# Altium schematic sheet Testboard_schematics.SchDoc
size 594 x 420 mm; SheetNumber: 1; SheetTotal: 8
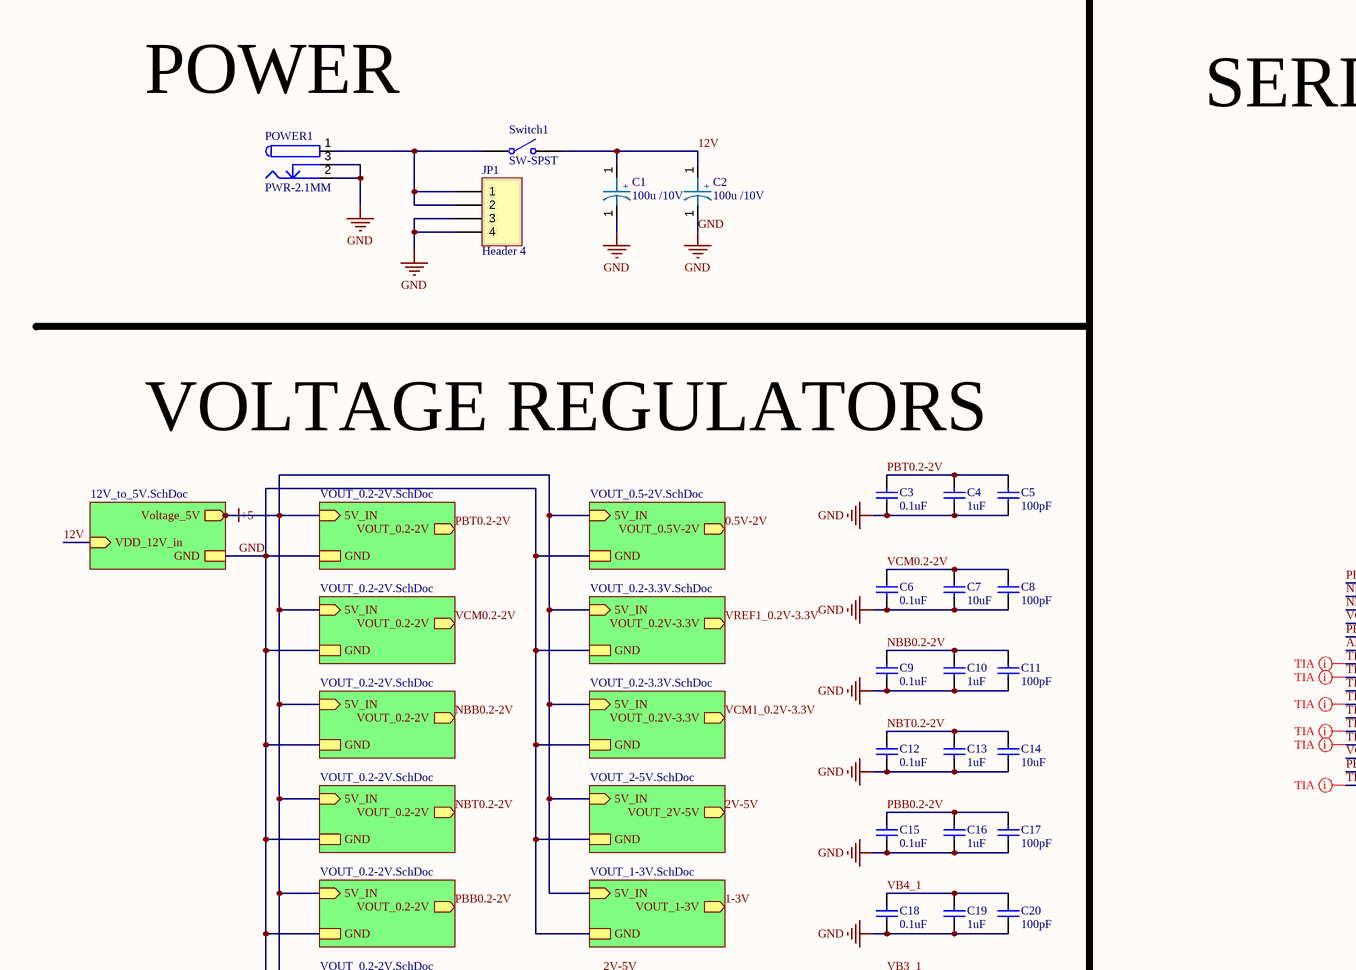
[diagram p0: Testboard_schematics.SchDoc, top left]
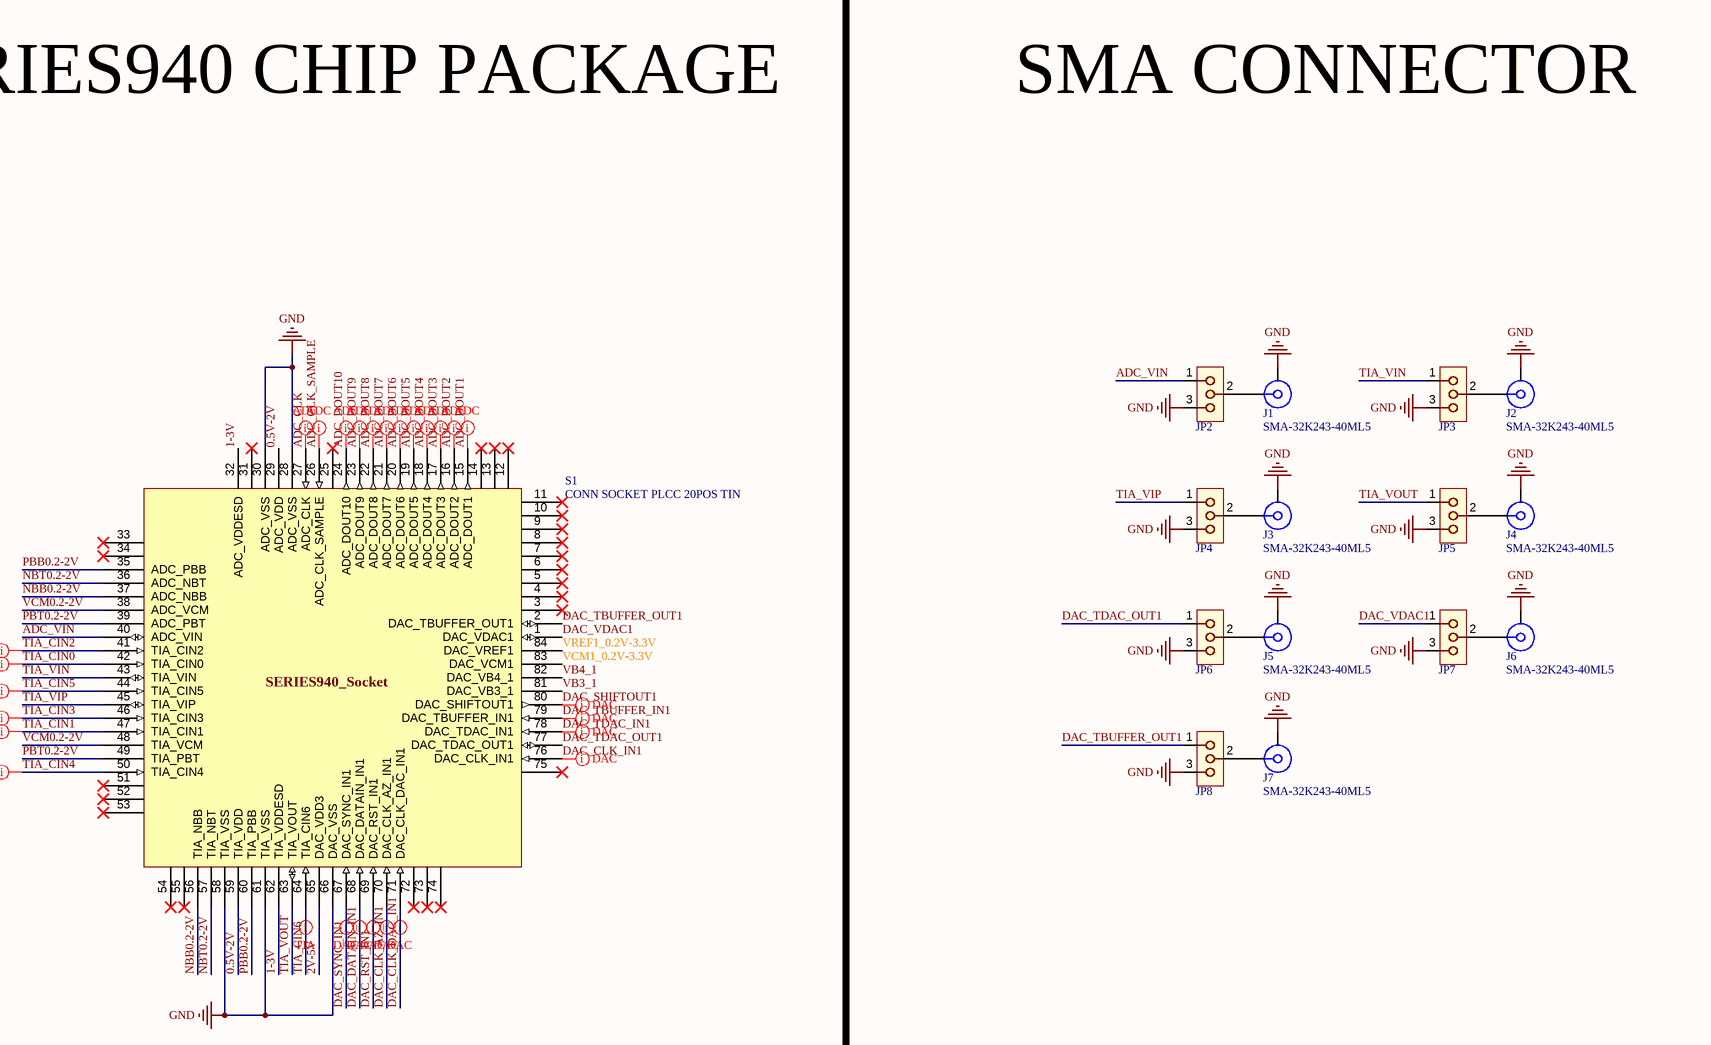
[diagram p1: Testboard_schematics.SchDoc, top right]
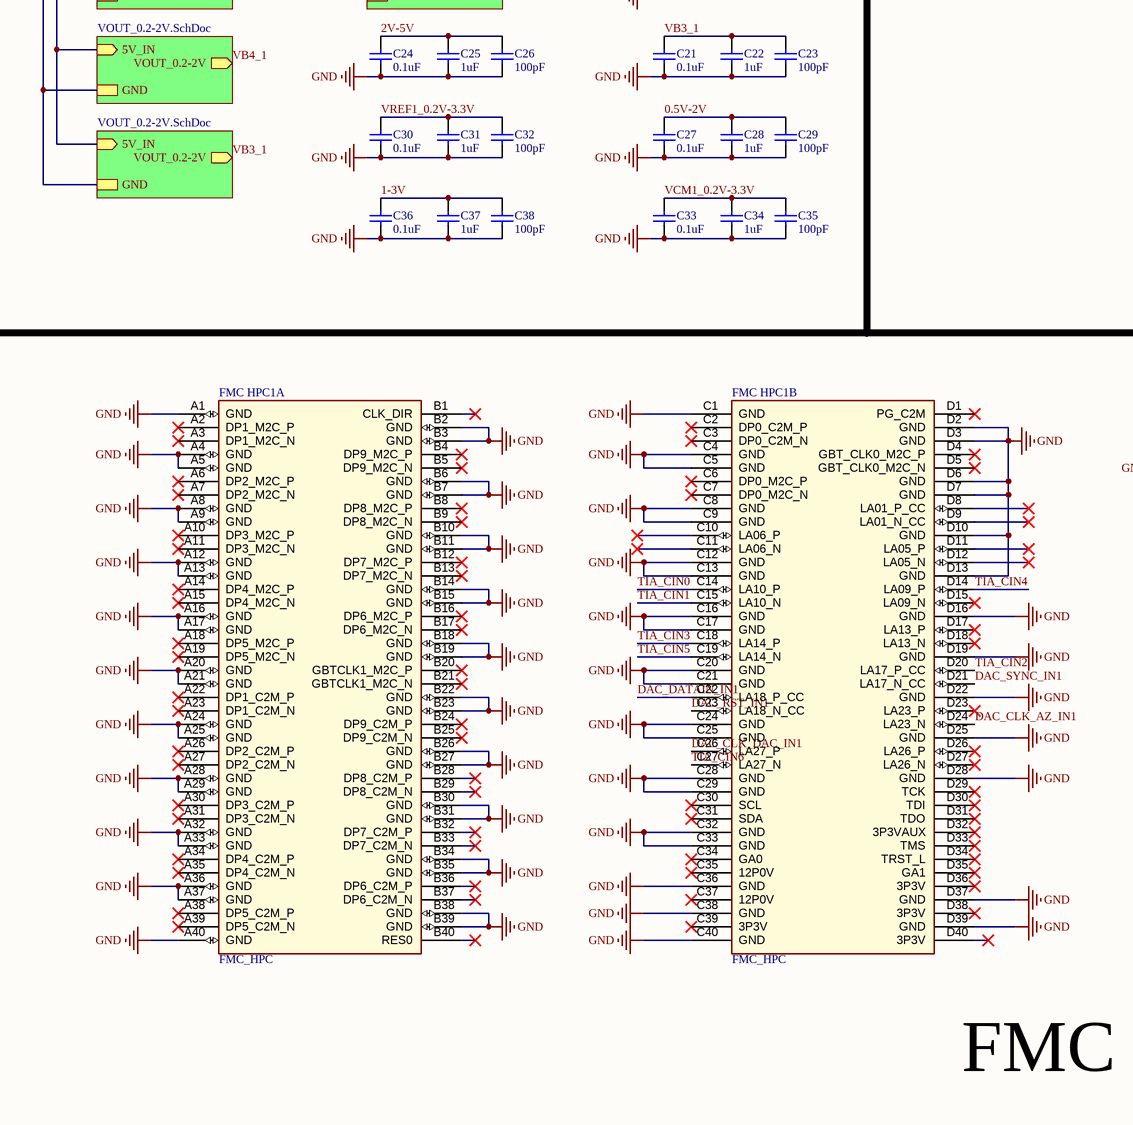
[diagram p2: Testboard_schematics.SchDoc, bottom left]
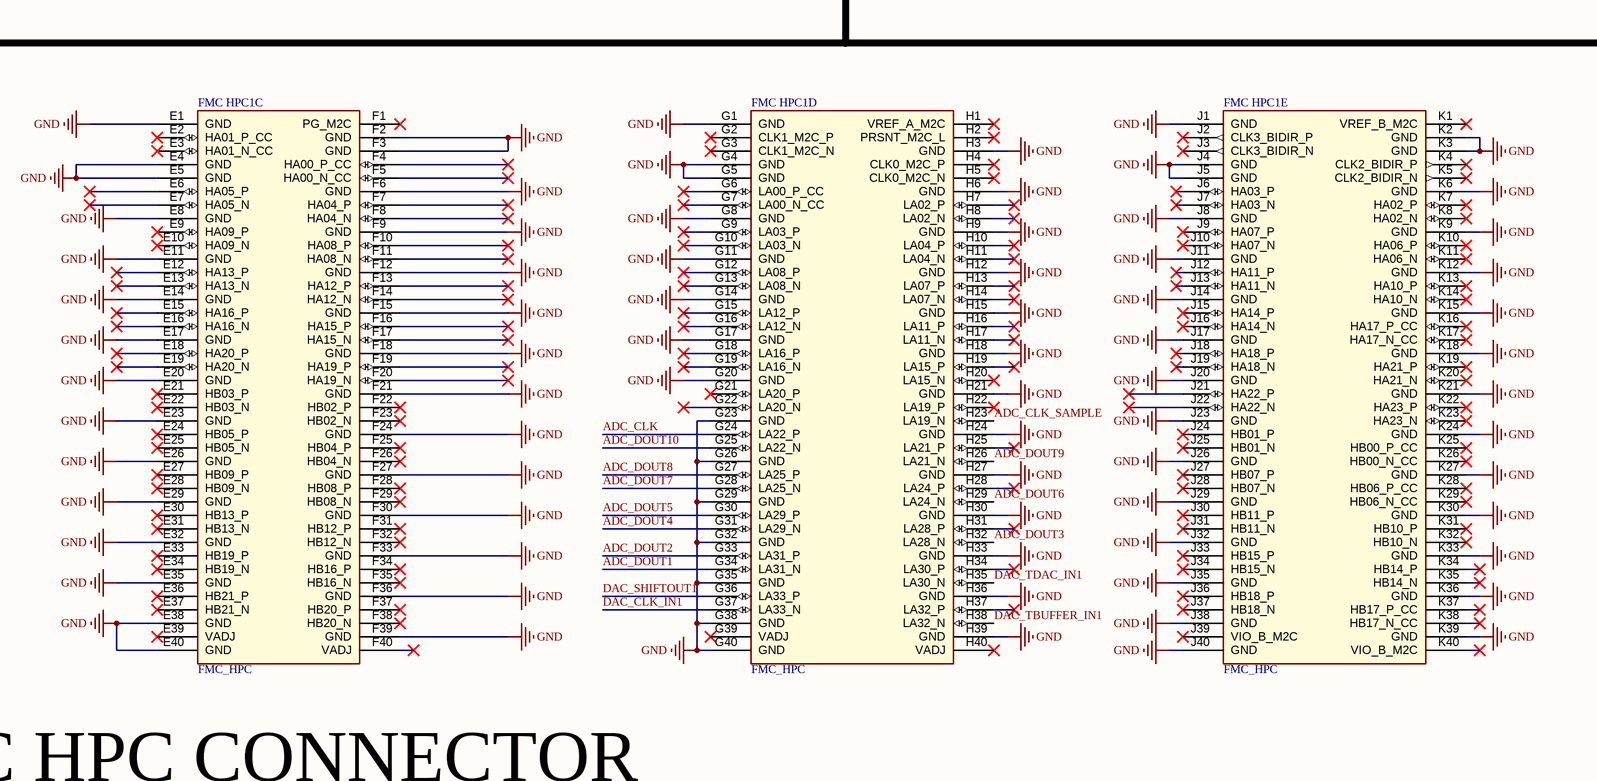
[diagram p3: Testboard_schematics.SchDoc, bottom right]

## Parts
C1  100u /10V  [C_ALU_C_SIZE]
C2  100u /10V  [C_ALU_C_SIZE]
C3  0.1uF  [C0805]
C4  1uF  [C0805]
C5  100pF  [C0805]
C6  0.1uF  [C0805]
C7  10uF  [C0805]
C8  100pF  [C0805]
C9  0.1uF  [C0805]
C10  1uF  [C0805]
C11  100pF  [C0805]
C12  0.1uF  [C0805]
C13  1uF  [C0805]
C14  10uF  [C0805]
C15  0.1uF  [C0805]
C16  1uF  [C0805]
C17  100pF  [C0805]
C18  0.1uF  [C0805]
C19  1uF  [C0805]
C20  100pF  [C0805]
C21  0.1uF  [C0805]
C22  1uF  [C0805]
C23  100pF  [C0805]
C24  0.1uF  [C0805]
C25  1uF  [C0805]
C26  100pF  [C0805]
C27  0.1uF  [C0805]
C28  1uF  [C0805]
C29  100pF  [C0805]
C30  0.1uF  [C0805]
C31  1uF  [C0805]
C32  100pF  [C0805]
C33  0.1uF  [C0805]
C34  1uF  [C0805]
C35  100pF  [C0805]
C36  0.1uF  [C0805]
C37  1uF  [C0805]
C38  100pF  [C0805]
FMC_HPC1  FMC_HPC  [FMC_HPC]  (parts A,B,C,D,E of 5)
J1  SMA-32K243-40ML5  [ROS-32K243-40ML5_V]
J2  SMA-32K243-40ML5  [ROS-32K243-40ML5_V]
J3  SMA-32K243-40ML5  [ROS-32K243-40ML5_V]
J4  SMA-32K243-40ML5  [ROS-32K243-40ML5_V]
J5  SMA-32K243-40ML5  [ROS-32K243-40ML5_V]
J6  SMA-32K243-40ML5  [ROS-32K243-40ML5_V]
J7  SMA-32K243-40ML5  [ROS-32K243-40ML5_V]
JP1  Header 4  [HDR1X4]
JP2  Jumper  [01x03_0.1in_th_straight_b_nom]  (value not drawn)
JP3  Jumper  [01x03_0.1in_th_straight_b_nom]  (value not drawn)
JP4  Jumper  [01x03_0.1in_th_straight_b_nom]  (value not drawn)
JP5  Jumper  [01x03_0.1in_th_straight_b_nom]  (value not drawn)
JP6  Jumper  [01x03_0.1in_th_straight_b_nom]  (value not drawn)
JP7  Jumper  [01x03_0.1in_th_straight_b_nom]  (value not drawn)
JP8  Jumper  [01x03_0.1in_th_straight_b_nom]  (value not drawn)
POWER1  PWR-2.1MM  [POWER2.1MM]
S1  CONN SOCKET PLCC 20POS TIN  [SERIES940_Socket]
Switch1  SW-SPST  [SPST-2]

## Sub-sheets
12V_to_5V = 12V_to_5V.SchDoc: VDD_12V_in (in), GND, Voltage_5V (out)
VOUT_0.2-2V = VOUT_0.2-2V.SchDoc: 5V_IN (in), GND, VOUT_0.2-2V (out)
VOUT_0.2-2V = VOUT_0.2-2V.SchDoc: 5V_IN (in), GND, VOUT_0.2-2V (out)
VOUT_0.2-2V = VOUT_0.2-2V.SchDoc: 5V_IN (in), GND, VOUT_0.2-2V (out)
VOUT_0.2-2V = VOUT_0.2-2V.SchDoc: 5V_IN (in), GND, VOUT_0.2-2V (out)
VOUT_0.2-2V = VOUT_0.2-2V.SchDoc: 5V_IN (in), GND, VOUT_0.2-2V (out)
VOUT_0.2-2V = VOUT_0.2-2V.SchDoc: 5V_IN (in), GND, VOUT_0.2-2V (out)
VOUT_0.2-2V = VOUT_0.2-2V.SchDoc: 5V_IN (in), GND, VOUT_0.2-2V (out)
VOUT_0.2V-3.3V = VOUT_0.2-3.3V.SchDoc: 5V_IN (in), GND, VOUT_0.2V-3.3V (out)
VOUT_0.2V-3.3V = VOUT_0.2-3.3V.SchDoc: 5V_IN (in), GND, VOUT_0.2V-3.3V (out)
VOUT_0.5V-2V = VOUT_0.5-2V.SchDoc: 5V_IN (in), GND, VOUT_0.5V-2V (out)
VOUT_0.9V-5V = VOUT_1-3V.SchDoc: 5V_IN (in), GND, VOUT_1-3V (out)
VOUT_2V-5V = VOUT_2-5V.SchDoc: 5V_IN (in), GND, VOUT_2V-5V (out)

## Nets
+5: sheet 12V_to_5V/Voltage_5V, sheet VOUT_2V-5V/5V_IN, sheet VOUT_0.2-2V/5V_IN, sheet VOUT_0.9V-5V/5V_IN, sheet VOUT_0.5V-2V/5V_IN, sheet VOUT_0.2V-3.3V/5V_IN, sheet VOUT_0.2-2V/5V_IN, sheet VOUT_0.2-2V/5V_IN, sheet VOUT_0.2-2V/5V_IN, sheet VOUT_0.2-2V/5V_IN, sheet VOUT_0.2-2V/5V_IN, sheet VOUT_0.2-2V/5V_IN, sheet VOUT_0.2V-3.3V/5V_IN
GND: C1.1 C2.1 C3.1 C4.2 C5.1 C6.1 C7.1 C8.1 C9.1 C10.2 C11.1 C12.1 C13.2 C14.1 C15.1 C16.2 C17.1 C18.1 C19.2 C20.1 C21.1 C22.2 C23.1 C24.1 C25.2 C26.1 C27.1 C28.2 C29.1 C30.1 C31.2 C32.1 C33.1 C34.2 C35.1 C36.1 C37.2 C38.1 FMC_HPC1.A1(GND) FMC_HPC1.A4(GND) FMC_HPC1.A5(GND) FMC_HPC1.A8(GND) FMC_HPC1.A9(GND) FMC_HPC1.A12(GND) FMC_HPC1.A13(GND) FMC_HPC1.A16(GND) FMC_HPC1.A17(GND) FMC_HPC1.A20(GND) FMC_HPC1.A21(GND) FMC_HPC1.A24(GND) FMC_HPC1.A25(GND) FMC_HPC1.A28(GND) FMC_HPC1.A29(GND) FMC_HPC1.A32(GND) FMC_HPC1.A33(GND) FMC_HPC1.A36(GND) FMC_HPC1.A37(GND) FMC_HPC1.A40(GND) FMC_HPC1.B2(GND) FMC_HPC1.B3(GND) FMC_HPC1.B6(GND) FMC_HPC1.B7(GND) FMC_HPC1.B10(GND) FMC_HPC1.B11(GND) FMC_HPC1.B14(GND) FMC_HPC1.B15(GND) FMC_HPC1.B18(GND) FMC_HPC1.B19(GND) FMC_HPC1.B22(GND) FMC_HPC1.B23(GND) FMC_HPC1.B26(GND) FMC_HPC1.B27(GND) FMC_HPC1.B30(GND) FMC_HPC1.B31(GND) FMC_HPC1.B34(GND) FMC_HPC1.B35(GND) FMC_HPC1.B38(GND) FMC_HPC1.B39(GND) FMC_HPC1.C1(GND) FMC_HPC1.C4(GND) FMC_HPC1.C5(GND) FMC_HPC1.C8(GND) FMC_HPC1.C9(GND) FMC_HPC1.C12(GND) FMC_HPC1.C13(GND) FMC_HPC1.C16(GND) FMC_HPC1.C17(GND) FMC_HPC1.C20(GND) FMC_HPC1.C21(GND) FMC_HPC1.C24(GND) FMC_HPC1.C25(GND) FMC_HPC1.C28(GND) FMC_HPC1.C29(GND) FMC_HPC1.C32(GND) FMC_HPC1.C33(GND) FMC_HPC1.C36(GND) FMC_HPC1.C38(GND) FMC_HPC1.C40(GND) FMC_HPC1.D2(GND) FMC_HPC1.D3(GND) FMC_HPC1.D6(GND) FMC_HPC1.D7(GND) FMC_HPC1.D10(GND) FMC_HPC1.D13(GND) FMC_HPC1.D16(GND) FMC_HPC1.D19(GND) FMC_HPC1.D22(GND) FMC_HPC1.D25(GND) FMC_HPC1.D28(GND) FMC_HPC1.D37(GND) FMC_HPC1.D39(GND) FMC_HPC1.E1(GND) FMC_HPC1.E4(GND) FMC_HPC1.E5(GND) FMC_HPC1.E8(GND) FMC_HPC1.E11(GND) FMC_HPC1.E14(GND) FMC_HPC1.E17(GND) FMC_HPC1.E20(GND) FMC_HPC1.E23(GND) FMC_HPC1.E26(GND) FMC_HPC1.E29(GND) FMC_HPC1.E32(GND) FMC_HPC1.E35(GND) FMC_HPC1.E38(GND) FMC_HPC1.E40(GND) FMC_HPC1.F2(GND) FMC_HPC1.F3(GND) FMC_HPC1.F6(GND) FMC_HPC1.F9(GND) FMC_HPC1.F12(GND) FMC_HPC1.F15(GND) FMC_HPC1.F18(GND) FMC_HPC1.F21(GND) FMC_HPC1.F24(GND) FMC_HPC1.F27(GND) FMC_HPC1.F30(GND) FMC_HPC1.F33(GND) FMC_HPC1.F36(GND) FMC_HPC1.F39(GND) FMC_HPC1.G1(GND) FMC_HPC1.G4(GND) FMC_HPC1.G5(GND) FMC_HPC1.G8(GND) FMC_HPC1.G11(GND) FMC_HPC1.G14(GND) FMC_HPC1.G17(GND) FMC_HPC1.G20(GND) FMC_HPC1.G23(GND) FMC_HPC1.G26(GND) FMC_HPC1.G29(GND) FMC_HPC1.G32(GND) FMC_HPC1.G35(GND) FMC_HPC1.G38(GND) FMC_HPC1.G40(GND) FMC_HPC1.H3(GND) FMC_HPC1.H6(GND) FMC_HPC1.H9(GND) FMC_HPC1.H12(GND) FMC_HPC1.H15(GND) FMC_HPC1.H18(GND) FMC_HPC1.H21(GND) FMC_HPC1.H24(GND) FMC_HPC1.H27(GND) FMC_HPC1.H30(GND) FMC_HPC1.H33(GND) FMC_HPC1.H36(GND) FMC_HPC1.H39(GND) FMC_HPC1.J1(GND) FMC_HPC1.J4(GND) FMC_HPC1.J5(GND) FMC_HPC1.J8(GND) FMC_HPC1.J11(GND) FMC_HPC1.J14(GND) FMC_HPC1.J17(GND) FMC_HPC1.J20(GND) FMC_HPC1.J23(GND) FMC_HPC1.J26(GND) FMC_HPC1.J29(GND) FMC_HPC1.J32(GND) FMC_HPC1.J35(GND) FMC_HPC1.J38(GND) FMC_HPC1.J40(GND) FMC_HPC1.K2(GND) FMC_HPC1.K3(GND) FMC_HPC1.K6(GND) FMC_HPC1.K9(GND) FMC_HPC1.K12(GND) FMC_HPC1.K15(GND) FMC_HPC1.K18(GND) FMC_HPC1.K21(GND) FMC_HPC1.K24(GND) FMC_HPC1.K27(GND) FMC_HPC1.K30(GND) FMC_HPC1.K33(GND) FMC_HPC1.K36(GND) FMC_HPC1.K39(GND) J1.MH J2.MH J3.MH J4.MH J5.MH J6.MH J7.MH JP1.3 JP1.4 JP2.3 JP3.3 JP4.3 JP5.3 JP6.3 JP7.3 JP8.3 POWER1.2 POWER1.3 S1.28(ADC_VSS) S1.30(ADC_VSS) S1.58(TIA_VSS) S1.61(TIA_VSS) S1.66(DAC_VSS) ; sheet 12V_to_5V/GND, sheet VOUT_2V-5V/GND, sheet VOUT_0.2-2V/GND, sheet VOUT_0.9V-5V/GND, sheet VOUT_0.5V-2V/GND, sheet VOUT_0.2V-3.3V/GND, sheet VOUT_0.2-2V/GND, sheet VOUT_0.2-2V/GND, sheet VOUT_0.2-2V/GND, sheet VOUT_0.2-2V/GND, sheet VOUT_0.2-2V/GND, sheet VOUT_0.2-2V/GND, sheet VOUT_0.2V-3.3V/GND
0.5V-2V: C27.2 C28.1 C29.2 S1.29(ADC_VDD) S1.59(TIA_VDD) ; sheet VOUT_0.5V-2V/VOUT_0.5V-2V
1-3V: C36.2 C37.1 C38.2 S1.32(ADC_VDDESD) S1.62(TIA_VDDESD) ; sheet VOUT_0.9V-5V/VOUT_1-3V
2V-5V: C24.2 C25.1 C26.2 S1.65(DAC_VDD3) ; sheet VOUT_2V-5V/VOUT_2V-5V
12V: C1.1 C2.1 Switch1.2(NO) ; sheet 12V_to_5V/VDD_12V_in
ADC_CLK: FMC_HPC1.G24(LA22_P) S1.27(ADC_CLK)
ADC_CLK_SAMPLE: FMC_HPC1.H23(LA19_N) S1.26(ADC_CLK_SAMPLE)
ADC_DOUT1: FMC_HPC1.G34(LA31_N) S1.15(ADC_DOUT1)
ADC_DOUT2: FMC_HPC1.G33(LA31_P) S1.16(ADC_DOUT2)
ADC_DOUT3: FMC_HPC1.H32(LA28_N) S1.17(ADC_DOUT3)
ADC_DOUT4: FMC_HPC1.G31(LA29_N) S1.18(ADC_DOUT4)
ADC_DOUT5: FMC_HPC1.G30(LA29_P) S1.19(ADC_DOUT5)
ADC_DOUT6: FMC_HPC1.H29(LA24_N) S1.20(ADC_DOUT6)
ADC_DOUT7: FMC_HPC1.G28(LA25_N) S1.21(ADC_DOUT7)
ADC_DOUT8: FMC_HPC1.G27(LA25_P) S1.22(ADC_DOUT8)
ADC_DOUT9: FMC_HPC1.H26(LA21_N) S1.23(ADC_DOUT9)
ADC_DOUT10: FMC_HPC1.G25(LA22_N) S1.24(ADC_DOUT10)
ADC_VIN: JP2.1 S1.40(ADC_VIN)
DAC_CLK_AZ_IN1: FMC_HPC1.D24(LA23_N) S1.70(DAC_CLK_AZ_IN1)
DAC_CLK_DAC_IN1: FMC_HPC1.C26(LA27_P) S1.71(DAC_CLK_DAC_IN1)
DAC_CLK_IN1: FMC_HPC1.G37(LA33_N) S1.76(DAC_CLK_IN1)
DAC_DATAIN_IN1: FMC_HPC1.C22(LA18_P_CC) S1.68(DAC_DATAIN_IN1)
DAC_RST_IN1: FMC_HPC1.C23(LA18_N_CC) S1.69(DAC_RST_IN1)
DAC_SHIFTOUT1: FMC_HPC1.G36(LA33_P) S1.80(DAC_SHIFTOUT1)
DAC_SYNC_IN1: FMC_HPC1.D21(LA17_N_CC) S1.67(DAC_SYNC_IN1)
DAC_TBUFFER_IN1: FMC_HPC1.H38(LA32_N) S1.79(DAC_TBUFFER_IN1)
DAC_TBUFFER_OUT1: JP8.1 S1.2(DAC_TBUFFER_OUT1)
DAC_TDAC_IN1: FMC_HPC1.H35(LA30_N) S1.78(DAC_TDAC_IN1)
DAC_TDAC_OUT1: JP6.1 S1.77(DAC_TDAC_OUT1)
DAC_VDAC1: JP7.1 S1.1(DAC_VDAC1)
NBB0.2-2V: C9.2 C10.1 C11.2 S1.37(ADC_NBB) S1.56(TIA_NBB) ; sheet VOUT_0.2-2V/VOUT_0.2-2V
NBT0.2-2V: C12.2 C13.1 C14.2 S1.36(ADC_NBT) S1.57(TIA_NBT) ; sheet VOUT_0.2-2V/VOUT_0.2-2V
PBB0.2-2V: C15.2 C16.1 C17.2 S1.35(ADC_PBB) S1.60(TIA_PBB) ; sheet VOUT_0.2-2V/VOUT_0.2-2V
PBT0.2-2V: C3.2 C4.1 C5.2 S1.39(ADC_PBT) S1.49(TIA_PBT) ; sheet VOUT_0.2-2V/VOUT_0.2-2V
TIA_CIN0: FMC_HPC1.C14(LA10_P) S1.42(TIA_CIN0)
TIA_CIN1: FMC_HPC1.C15(LA10_N) S1.47(TIA_CIN1)
TIA_CIN2: FMC_HPC1.D20(LA17_P_CC) S1.41(TIA_CIN2)
TIA_CIN3: FMC_HPC1.C18(LA14_P) S1.46(TIA_CIN3)
TIA_CIN4: FMC_HPC1.D14(LA09_P) S1.50(TIA_CIN4)
TIA_CIN5: FMC_HPC1.C19(LA14_N) S1.44(TIA_CIN5)
TIA_CIN6: FMC_HPC1.C27(LA27_N) S1.64(TIA_CIN6)
TIA_VIN: JP3.1 S1.43(TIA_VIN)
TIA_VIP: JP4.1 S1.45(TIA_VIP)
TIA_VOUT: JP5.1 S1.63(TIA_VOUT)
VB3_1: C21.2 C22.1 C23.2 S1.81(DAC_VB3_1) ; sheet VOUT_0.2-2V/VOUT_0.2-2V
VB4_1: C18.2 C19.1 C20.2 S1.82(DAC_VB4_1) ; sheet VOUT_0.2-2V/VOUT_0.2-2V
VCM0.2-2V: C6.2 C7.2 C8.2 S1.38(ADC_VCM) S1.48(TIA_VCM) ; sheet VOUT_0.2-2V/VOUT_0.2-2V
VCM1_0.2V-3.3V: C33.2 C34.1 C35.2 S1.83(DAC_VCM1) ; sheet VOUT_0.2V-3.3V/VOUT_0.2V-3.3V
VREF1_0.2V-3.3V: C30.2 C31.1 C32.2 S1.84(DAC_VREF1) ; sheet VOUT_0.2V-3.3V/VOUT_0.2V-3.3V
NetJ1_1: J1.1 JP2.2
NetJ2_1: J2.1 JP3.2
NetJ3_1: J3.1 JP4.2
NetJ4_1: J4.1 JP5.2
NetJ5_1: J5.1 JP6.2
NetJ6_1: J6.1 JP7.2
NetJ7_1: J7.1 JP8.2
NetJP1_1: JP1.1 JP1.2 POWER1.1 Switch1.1(COMMON)

Not connected (* = marked no-connect by the designer): FMC_HPC1 A2(DP1_M2C_P)* A3(DP1_M2C_N)* A6(DP2_M2C_P)* A7(DP2_M2C_N)* A10(DP3_M2C_P)* A11(DP3_M2C_N)* A14(DP4_M2C_P)* A15(DP4_M2C_N)* A18(DP5_M2C_P)* A19(DP5_M2C_N)* A22(DP1_C2M_P)* A23(DP1_C2M_N)* A26(DP2_C2M_P)* A27(DP2_C2M_N)* A30(DP3_C2M_P)* A31(DP3_C2M_N)* A34(DP4_C2M_P)* A35(DP4_C2M_N)* A38(DP5_C2M_P)* A39(DP5_C2M_N)* B1(CLK_DIR)* B4(DP9_M2C_P)* B5(DP9_M2C_N)* B8(DP8_M2C_P)* B9(DP8_M2C_N)* B12(DP7_M2C_P)* B13(DP7_M2C_N)* B16(DP6_M2C_P)* B17(DP6_M2C_N)* B20(GBTCLK1_M2C_P)* B21(GBTCLK1_M2C_N)* B24(DP9_C2M_P)* B25(DP9_C2M_N)* B28(DP8_C2M_P)* B29(DP8_C2M_N)* B32(DP7_C2M_P)* B33(DP7_C2M_N)* B36(DP6_C2M_P)* B37(DP6_C2M_N)* B40(RES0)* C2(DP0_C2M_P)* C3(DP0_C2M_N)* C6(DP0_M2C_P)* C7(DP0_M2C_N)* C10(LA06_P)* C11(LA06_N)* C30(SCL)* C31(SDA)* C34(GA0)* C35(12P0V)* C37(12P0V)* C39(3P3V)* D1(PG_C2M)* D4(GBT_CLK0_M2C_P)* D5(GBT_CLK0_M2C_N)* D8(LA01_P_CC)* D9(LA01_N_CC)* D11(LA05_P)* D12(LA05_N)* D15(LA09_N)* D17(LA13_P)* D18(LA13_N)* D23(LA23_P)* D26(LA26_P)* D27(LA26_N)* D29(TCK)* D30(TDI)* D31(TDO)* D32(3P3VAUX)* D33(TMS)* D34(TRST_L)* D35(GA1)* D36(3P3V)* D38(3P3V)* D40(3P3V)* E2(HA01_P_CC)* E3(HA01_N_CC)* E6(HA05_P)* E7(HA05_N)* E9(HA09_P)* E10(HA09_N)* E12(HA13_P)* E13(HA13_N)* E15(HA16_P)* E16(HA16_N)* E18(HA20_P)* E19(HA20_N)* E21(HB03_P)* E22(HB03_N)* E24(HB05_P)* E25(HB05_N)* E27(HB09_P)* E28(HB09_N)* E30(HB13_P)* E31(HB13_N)* E33(HB19_P)* E34(HB19_N)* E36(HB21_P)* E37(HB21_N)* E39(VADJ)* F1(PG_M2C)* F4(HA00_P_CC)* F5(HA00_N_CC)* F7(HA04_P)* F8(HA04_N)* F10(HA08_P)* F11(HA08_N)* F13(HA12_P)* F14(HA12_N)* F16(HA15_P)* F17(HA15_N)* F19(HA19_P)* F20(HA19_N)* F22(HB02_P)* F23(HB02_N)* F25(HB04_P)* F26(HB04_N)* F28(HB08_P)* F29(HB08_N)* F31(HB12_P)* F32(HB12_N)* F34(HB16_P)* F35(HB16_N)* F37(HB20_P)* F38(HB20_N)* F40(VADJ)* G2(CLK1_M2C_P)* G3(CLK1_M2C_N)* G6(LA00_P_CC)* G7(LA00_N_CC)* G9(LA03_P)* G10(LA03_N)* G12(LA08_P)* G13(LA08_N)* G15(LA12_P)* G16(LA12_N)* G18(LA16_P)* G19(LA16_N)* G21(LA20_P)* G22(LA20_N)* G39(VADJ)* H1(VREF_A_M2C)* H2(PRSNT_M2C_L)* H4(CLK0_M2C_P)* H5(CLK0_M2C_N)* H7(LA02_P)* H8(LA02_N)* H10(LA04_P)* H11(LA04_N)* H13(LA07_P)* H14(LA07_N)* H16(LA11_P)* H17(LA11_N)* H19(LA15_P)* H20(LA15_N)* H22(LA19_P)* H25(LA21_P)* H28(LA24_P)* H31(LA28_P)* H34(LA30_P)* H37(LA32_P)* H40(VADJ)* J2(CLK3_BIDIR_P)* J3(CLK3_BIDIR_N)* J6(HA03_P)* J7(HA03_N)* J9(HA07_P)* J10(HA07_N)* J12(HA11_P)* J13(HA11_N)* J15(HA14_P)* J16(HA14_N)* J18(HA18_P)* J19(HA18_N)* J21(HA22_P)* J22(HA22_N)* J24(HB01_P)* J25(HB01_N)* J27(HB07_P)* J28(HB07_N)* J30(HB11_P)* J31(HB11_N)* J33(HB15_P)* J34(HB15_N)* J36(HB18_P)* J37(HB18_N)* J39(VIO_B_M2C)* K1(VREF_B_M2C)* K4(CLK2_BIDIR_P)* K5(CLK2_BIDIR_N)* K7(HA02_P)* K8(HA02_N)* K10(HA06_P)* K11(HA06_N)* K13(HA10_P)* K14(HA10_N)* K16(HA17_P_CC)* K17(HA17_N_CC)* K19(HA21_P)* K20(HA21_N)* K22(HA23_P)* K23(HA23_N)* K25(HB00_P_CC)* K26(HB00_N_CC)* K28(HB06_P_CC)* K29(HB06_N_CC)* K31(HB10_P)* K32(HB10_N)* K34(HB14_P)* K35(HB14_N)* K37(HB17_P_CC)* K38(HB17_N_CC)* K40(VIO_B_M2C)*; S1 3* 4* 5* 6* 7* 8* 9* 10* 11* 12* 13* 14* 25* 31* 33* 34* 51* 52* 53* 54* 55* 72* 73* 74* 75*

## Layout directives
net class TIA: TIA_CIN0, TIA_CIN1, TIA_CIN2, TIA_CIN3, TIA_CIN4, TIA_CIN5, TIA_CIN6
net class ADC: ADC_CLK, ADC_CLK_SAMPLE, ADC_DOUT1, ADC_DOUT2, ADC_DOUT3, ADC_DOUT4, ADC_DOUT5, ADC_DOUT6, ADC_DOUT7, ADC_DOUT8, ADC_DOUT9, ADC_DOUT10
net class DAC: DAC_CLK_AZ_IN1, DAC_CLK_DAC_IN1, DAC_CLK_IN1, DAC_DATAIN_IN1, DAC_RST_IN1, DAC_SHIFTOUT1, DAC_SYNC_IN1, DAC_TBUFFER_IN1, DAC_TDAC_IN1

## Notes on the sheet
- (near POWER1) POWER
- SERIES940 CHIP PACKAGE
- SMA CONNECTOR
- VOLTAGE REGULATORS
- FMC HPC CONNECTOR
- DWG NO:
- REV:
- THIS DOCUMENT AND THE DATA DISCLOSED HEREIN OR
- HEREWITH IS THE PROPERTY OF ALTIUM LIMITED AND MAY
- BE FREELY DISTRIBUTED IN WHOLE. NO RIGHTS ARE
- RESERVED OR EXPRESS OR IMPLIED WARANTEE GIVEN.
- REVISION
- DESCRIPTION
- DATE
- APPROVED
- ENG:
- APPROVALS
- PROJECT
- DSN:
- CHK:
- REFERENCE DOCUMENTS
- PROJECT REVISION:
- TITLE
- DOCUMENT REVISION:
- DESIGN ITEM:
- BOM:
- FAB DWG:
- PCB DWG:
- ASSY DWG:
- SCALE:
- A2
- SIZE
- CAGE CODE
- FILE NAME
- DWG NO.
- SHEET
- OF
- REV
- (in symbol 940-44-020-24-000000) SERIES940_Socket
- (in symbol CAP-10uF) +

## Library data of the parts
C1 C2 = CAP-10uF: CAP ALUM 100UF 20% 10V SMD; Manufacturer: Panasonic Electronic Components; Manufacturer Part Number: EEE-1AA101WR; Lifetime @ Temp.: 1000 Hrs @ 85°C; Polarization: Polar; Surface Mount Land Size: 0.209" L x 0.209" W (5.30mm x 5.30mm); Supplier 1: Digi-Key; RoHS: RoHS Compliant; Category: Capacitors; Stock 1: 89696; Pricing 1: 1=0.31, 10=0.212, 100=0.1272, 500=0.09538 (USD); Packaging: Cut Tape (CT); Part Status: Active; Tolerance: ±20%; ESR (Equivalent Series Resistance): -; Operating Temperature: -40°C ~ 85°C; Ratings: AEC-Q200; Applications: Automotive; Lead Spacing: -; Size / Dimension: 0.197" Dia (5.00mm); Height - Seated (Max): 0.213" (5.40mm); Mounting Type: Surface Mount; Package / Case: Radial, Can - SMD; ComponentLink1URL: https://industrial.panasonic.com/cdbs/www-data/pdf/RDE0000/ABA0000C1145.pdf; ComponentLink1Description: https://industrial.panasonic.com/cdbs/www-data/pdf/RDE0000/ABA0000C1145.pdf; Supplier Part Number 1: PCE3867CT-ND
C3 C6 C9 C12 C15 C18 C21 C24 C27 C30 C33 C36 = Cap 0.1uF: Manufacturer: Taiyo Yuden; Manufacturer Part Number: UMK212SD103KD-T; Dielectric Material: Ceramic; Capacitance: 10nF; Tolerance: 10%; Voltage Rating: 50V; Supplier 1: Digi-Key; Stock 1: 14125; Pricing 1: 1=0.47, 10=0.323, 100=0.1941, 500=0.1455, 1000=0.1229 (USD); Mount: Surface Mount; Case/Package: 0805; Number of Pins: 2; Case Code (Metric): 2012; Case Code (Imperial): 0805; Min Operating Temperature: -55°C; Max Operating Temperature: 125°C; Packaging: Tape and Reel; Package Quantity: 1; Voltage Rating (DC): 50V; Termination: SMD/SMT; Length: 2mm; Height: 0.85mm; Width: 0.049inch; Thickness: 0.037inch; Depth: 1.25mm; Radiation Hardening: No; Lead Free: Lead Free; Halogen Free: Halogen Free; ComponentLink1URL: https://datasheet.ciiva.com/138/umk212sd103kd-t-ss-138661.pdf; ComponentLink1Description: https://datasheet.ciiva.com/138/umk212sd103kd-t-ss-138661.pdf; ComponentLink2URL: https://datasheet.ciiva.com/138/mlcc07-e-138662.pdf; ComponentLink2Description: https://datasheet.ciiva.com/138/mlcc07-e-138662.pdf; ComponentLink3URL: https://datasheet.ciiva.com/138/mlcc07-e-138663.pdf; ComponentLink3Description: https://datasheet.ciiva.com/138/mlcc07-e-138663.pdf; ComponentLink4URL: https://datasheet.ciiva.com/30140/303umk212sd103kd-t-30140925.pdf; ComponentLink4Description: https://datasheet.ciiva.com/30140/303umk212sd103kd-t-30140925.pdf; Supplier Part Number 1: 587-1114-1-ND
C4 C7 C10 C13 C16 C19 C22 C25 C28 C31 C34 C37 = Cap 1uF: Manufacturer: Taiyo Yuden; Manufacturer Part Number: UMK212SD103KD-T; Dielectric Material: Ceramic; Capacitance: 10nF; Tolerance: 10%; Voltage Rating: 50V; Supplier 1: Digi-Key; Stock 1: 14125; Pricing 1: 1=0.47, 10=0.323, 100=0.1941, 500=0.1455, 1000=0.1229 (USD); Mount: Surface Mount; Case/Package: 0805; Number of Pins: 2; Case Code (Metric): 2012; Case Code (Imperial): 0805; Min Operating Temperature: -55°C; Max Operating Temperature: 125°C; Packaging: Tape and Reel; Package Quantity: 1; Voltage Rating (DC): 50V; Termination: SMD/SMT; Length: 2mm; Height: 0.85mm; Width: 0.049inch; Thickness: 0.037inch; Depth: 1.25mm; Radiation Hardening: No; Lead Free: Lead Free; Halogen Free: Halogen Free; ComponentLink1URL: https://datasheet.ciiva.com/138/umk212sd103kd-t-ss-138661.pdf; ComponentLink1Description: https://datasheet.ciiva.com/138/umk212sd103kd-t-ss-138661.pdf; ComponentLink2URL: https://datasheet.ciiva.com/138/mlcc07-e-138662.pdf; ComponentLink2Description: https://datasheet.ciiva.com/138/mlcc07-e-138662.pdf; ComponentLink3URL: https://datasheet.ciiva.com/138/mlcc07-e-138663.pdf; ComponentLink3Description: https://datasheet.ciiva.com/138/mlcc07-e-138663.pdf; ComponentLink4URL: https://datasheet.ciiva.com/30140/303umk212sd103kd-t-30140925.pdf; ComponentLink4Description: https://datasheet.ciiva.com/30140/303umk212sd103kd-t-30140925.pdf; Supplier Part Number 1: 587-1114-1-ND
C5 C8 C11 C14 C17 C20 C23 C26 C29 C32 C35 C38 = Cap 100pF: Manufacturer: Taiyo Yuden; Manufacturer Part Number: UMK212SD103KD-T; Dielectric Material: Ceramic; Capacitance: 10nF; Tolerance: 10%; Voltage Rating: 50V; Supplier 1: Digi-Key; Stock 1: 14125; Pricing 1: 1=0.47, 10=0.323, 100=0.1941, 500=0.1455, 1000=0.1229 (USD); Mount: Surface Mount; Case/Package: 0805; Number of Pins: 2; Case Code (Metric): 2012; Case Code (Imperial): 0805; Min Operating Temperature: -55°C; Max Operating Temperature: 125°C; Packaging: Tape and Reel; Package Quantity: 1; Voltage Rating (DC): 50V; Termination: SMD/SMT; Length: 2mm; Height: 0.85mm; Width: 0.049inch; Thickness: 0.037inch; Depth: 1.25mm; Radiation Hardening: No; Lead Free: Lead Free; Halogen Free: Halogen Free; ComponentLink1URL: https://datasheet.ciiva.com/138/umk212sd103kd-t-ss-138661.pdf; ComponentLink1Description: https://datasheet.ciiva.com/138/umk212sd103kd-t-ss-138661.pdf; ComponentLink2URL: https://datasheet.ciiva.com/138/mlcc07-e-138662.pdf; ComponentLink2Description: https://datasheet.ciiva.com/138/mlcc07-e-138662.pdf; ComponentLink3URL: https://datasheet.ciiva.com/138/mlcc07-e-138663.pdf; ComponentLink3Description: https://datasheet.ciiva.com/138/mlcc07-e-138663.pdf; ComponentLink4URL: https://datasheet.ciiva.com/30140/303umk212sd103kd-t-30140925.pdf; ComponentLink4Description: https://datasheet.ciiva.com/30140/303umk212sd103kd-t-30140925.pdf; Supplier Part Number 1: 587-1114-1-ND
J1-J7 = SMA-32K243-40ML5: SMA Right Angle Jack, Edge Mount Screw On, Heavy Duty, Up to 18 GHz, -65 to 165 degC; Design Note: Footprint in library is a generic example - only application specific footprint delivers High Performance; DatasheetVersion: c00; PackageVersion: c00; PackageReference: 32K243-40ML5; PackageDescription: SMA Right Angle Jack, Edge Mount Screw On, 14.50 x 14.00 x 5.15 mm; Mounting Technology: Surface Mount; PartNumber: 32K243-40ML5; ComponentLink1Description: Manufacturer URL; ComponentLink1URL: http://www.rosenberger.de; ComponentLink2Description: Datasheet; ComponentLink2URL: http://rosenberger.de/ok/images/documents/db/32K243-40ML5.pdf; ComponentLink3Description: Package Specification; ComponentLink3URL: http://rosenberger.de/ok/images/documents/db/32K243-40ML5.pdf; ComponentLink4Description: Series Overview / Design Note; ComponentLink4URL: http://rosenberger.de/ok/images/documents/spez/32.pdf; ComponentLink5Description: Webshop / RFQ; ComponentLink5URL: http://www.rosenberger.com/en/contact/sales/
JP1 = Header 4: Header, 4-Pin; LatestRevisionDate: 17-Jul-2002; LatestRevisionNote: Re-released for DXP Platform.; Publisher: Altium Limited
JP2-JP8 = Jumper-01x03: 01X03 generic terminal connector
POWER1 = PWR-2.1MM: PJ-002AH; Manufacturer: CUI; Gender: Male; Shielding: Unshielded; Connector Type: Jack; Current Rating: 5A; Number of Conductors: 2; Voltage Rating: 24V; Insulation Resistance: 50MR; Supplier 1: Digi-Key; Manufacturer Part Number: PJ-002AH; Stock 1: 95768; Pricing 1: 1=0.74, 10=0.696, 25=0.6264, 50=0.5568, 100=0.5336, 250=0.4872, 500=0.464, 1000=0.3828, 2500=0.348 (USD); Mount: Through Hole; Colour: Black; Contact Material: Copper,Copper Alloy; Contact Plating: Nickel; Housing Material: Thermoplastic; Housing Colour: Black; Min Operating Temperature: -25°C; Max Operating Temperature: 85°C; Packaging: Bulk; Termination: Through Hole; Orientation: Horizontal; Package Quantity: 500; Contact Gender: Male; Diameter: 2.1mm; Lead Free: Lead Free; Flammability Rating: UL94 V-0; ComponentLink1URL: http://www.cui.com/Product/Resource/FuturePDF/PJ-002AH.pdf; ComponentLink1Description: http://www.cui.com/Product/Resource/FuturePDF/PJ-002AH.pdf; ComponentLink2URL: http://www.cui.com/product/resource/digikeypdf/pj-002ah.pdf; ComponentLink2Description: http://www.cui.com/product/resource/digikeypdf/pj-002ah.pdf; ComponentLink3URL: http://www.mouser.com/ds/2/670/pj-002ah-516007.pdf; ComponentLink3Description: http://www.mouser.com/ds/2/670/pj-002ah-516007.pdf; Supplier Part Number 1: CP-002AH-ND
S1 = 940-44-020-24-000000: Manufacturer: Mill-Max; Body Material: PPS; Number of Positions: 20; Pitch: 0.1inch; Supplier 1: Digi-Key; Manufacturer Part Number: 940-44-020-24-000000; RoHS: Yes; Category: IC and Component Sockets; Stock 1: 458; Pricing 1: 1=1.60000, 10=1.44800, 25=1.35920, 50=1.30020, 100=1.24110, 250=1.12292, 500=1.03426, 1000=0.88650, 2500=0.82740 (USD); Mount: Through Hole; Case/Package: PLCC; Number of Pins: 20; Contact Plating: Tin; Contact Material: Copper; Housing Material: Polyphenylene; Insulation Material: Polyphenylene; Min Operating Temperature: -40°C; Max Operating Temperature: 120°C; Packaging: Rail/Tube; Package Quantity: 38; Number of Rows: 4; Termination: Solder; Number of Contacts: 20; Orientation: Straight; Series: 940; Contact Type: Type D; Length: 15.57mm; Width: 15.57mm; Depth: 15.57mm; Lead Free: Lead Free; RoHS Compliant: Yes; ComponentLink1URL: https://datasheet.ciiva.com/3963/940-44-020-24-000000-3963718.pdf?src-supplier=Arrow+Electronics; ComponentLink1Description: https://datasheet.ciiva.com/3963/940-44-020-24-000000-3963718.pdf?src-supplier=Arrow+Electronics; ComponentLink2URL: https://datasheet.ciiva.com/16425/9404402024000000-16425193.pdf?src-supplier=Future+Electronics; ComponentLink2Description: https://datasheet.ciiva.com/16425/9404402024000000-16425193.pdf?src-supplier=Future+Electronics; Supplier Part Number 1: ED90005-ND
Switch1 = SW-SPST: L101011MS02Q; Manufacturer: ITT C&K; Actuator Material: Nylon,Polyamide; Max Voltage Rating (AC): 250V; Max Voltage Rating (DC): 125V; Throw Configuration: SPST; Max Current Rating: 4A; Voltage Rating (DC): 28V; Contact Current Rating: 2A; Electrical Life: 10000Cycles; Switch Travel: 3.81mm; Switch Function: On-Off; Actuator Length: 5.08mm; Supplier 1: Digi-Key; Manufacturer Part Number: L101011MS02Q; Stock 1: 8267; Pricing 1: 1=1.65, 10=1.584, 25=1.5504, 50=1.3482, 100=1.3145, 250=1.2808, 500=1.0786, 1000=1.0112, 5000=0.9269 (USD); Mount: Through Hole; Contact Material: Copper; Contact Plating: Silver; Housing Material: Nylon; Min Operating Temperature: -30°C; Max Operating Temperature: 65°C; Termination: PC Pins; Voltage Rating (AC): 125V; Package Quantity: 1; Packaging: Bulk; Current Rating: 4A; Orientation: Straight; Length: 19.1mm; Depth: 10.8mm; Radiation Hardening: No; Lead Free: Lead Free; ComponentLink1URL: https://datasheet.ciiva.com/17406/l-10jun14-17406600.pdf; ComponentLink1Description: https://datasheet.ciiva.com/17406/l-10jun14-17406600.pdf; ComponentLink2URL: https://datasheet.ciiva.com/18147/getdatasheetpartid-301248-18147196.pdf; ComponentLink2Description: https://datasheet.ciiva.com/18147/getdatasheetpartid-301248-18147196.pdf; ComponentLink3URL: https://datasheet.ciiva.com/2889/l-10jun14-2889869.pdf; ComponentLink3Description: https://datasheet.ciiva.com/2889/l-10jun14-2889869.pdf; Supplier Part Number 1: CKC5106-ND